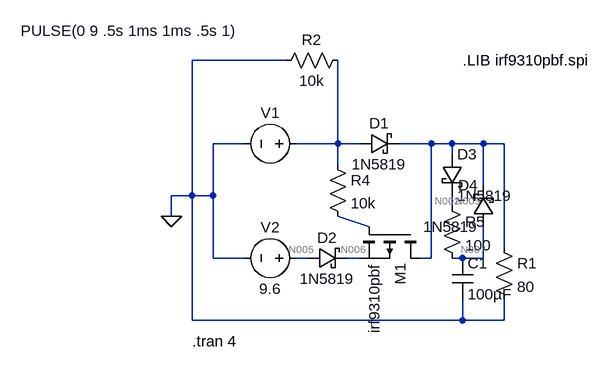
[diagram p0: schematic draft2.asc]
draft2.asc, the LTspice schematic file:
Version 4
SHEET 1 880 680
WIRE -16 -176 -160 -176
WIRE -80 -48 -128 -48
WIRE 64 -48 64 -176
WIRE 64 -48 0 -48
WIRE 96 -48 64 -48
WIRE 208 -48 160 -48
WIRE 240 -48 208 -48
WIRE 288 -48 240 -48
WIRE 320 -48 288 -48
WIRE 240 -32 240 -48
WIRE 64 -16 64 -48
WIRE 288 16 288 -48
WIRE -160 32 -160 -176
WIRE -160 32 -192 32
WIRE -128 32 -128 -48
WIRE -128 32 -160 32
WIRE 240 48 240 32
WIRE -192 64 -192 32
WIRE 112 80 64 64
WIRE 320 112 320 -48
WIRE -128 128 -128 32
WIRE -80 128 -128 128
WIRE 16 128 0 128
WIRE 96 128 80 128
WIRE 208 128 208 -48
WIRE 208 128 192 128
WIRE 256 128 240 128
WIRE 288 128 288 80
WIRE 288 128 256 128
WIRE -160 224 -160 32
WIRE 256 224 256 192
WIRE 256 224 -160 224
WIRE 320 224 320 192
WIRE 320 224 256 224
FLAG -192 64 0
SYMBOL res 304 96 R0
SYMATTR InstName R1
SYMATTR Value 80
SYMBOL voltage 16 -48 R90
WINDOW 0 -32 56 VBottom 2
WINDOW 3 -189 274 VTop 2
WINDOW 123 0 0 Left 0
WINDOW 39 0 0 Left 0
SYMATTR InstName V1
SYMATTR Value PULSE(0 9 .5s 1ms 1ms .5s 1)
SYMBOL voltage 16 128 R90
WINDOW 0 -32 56 VBottom 2
WINDOW 3 32 56 VTop 2
WINDOW 123 0 0 Left 0
WINDOW 39 0 0 Left 0
SYMATTR InstName V2
SYMATTR Value 9.6
SYMBOL pmos 192 80 R90
SYMATTR InstName M1
SYMATTR Value irf9310pbf
SYMATTR Prefix X
SYMBOL res 80 -192 R90
WINDOW 0 0 56 VBottom 2
WINDOW 3 32 56 VTop 2
SYMATTR InstName R2
SYMATTR Value 10k
SYMBOL schottky 96 -32 R270
WINDOW 0 32 32 VTop 2
WINDOW 3 0 32 VBottom 2
SYMATTR InstName D1
SYMATTR Value 1N5819
SYMBOL schottky 16 144 R270
WINDOW 0 32 32 VTop 2
WINDOW 3 0 32 VBottom 2
SYMATTR InstName D2
SYMATTR Value 1N5819
SYMBOL cap 240 128 R0
SYMATTR InstName C1
SYMATTR Value 100µF
SYMBOL res 48 -32 R0
SYMATTR InstName R4
SYMATTR Value 10k
SYMBOL schottky 224 -32 R0
SYMATTR InstName D3
SYMATTR Value 1N5819
SYMBOL res 224 32 R0
SYMATTR InstName R5
SYMATTR Value 100
SYMBOL schottky 304 80 R180
WINDOW 0 24 64 Left 2
WINDOW 3 24 0 Left 2
SYMATTR InstName D4
SYMATTR Value 1N5819
TEXT -160 256 Left 2 !.tran 4
TEXT 256 -176 Left 2 !.LIB irf9310pbf.spi

The netlist it stands for:
* draft2.asc
R1 N002 0 80
V1 N001 0 PULSE(0 9 .5s 1ms 1ms .5s 1)
V2 N005 0 9.6
XM1 N002 N004 N006 irf9310pbf  ; pins D G S
R2 N001 0 10k
D1 N001 N002 1N5819
D2 N005 N006 1N5819
C1 N007 0 100µF
R4 N001 N004 10k
D3 N002 N003 1N5819
R5 N003 N007 100
D4 N007 N002 1N5819
.model D D
.lib standard.dio
.tran 4
.LIB irf9310pbf.spi
.backanno
.end

* Results of the author's LTspice run, read from the files saved beside the schematic
* Operating Point, zero values left out:
*   V(n002) = 9.302 V
*   V(n005) = 9.6 V
*   V(n006) = 9.303 V
*   V(n007) = 9.302 V
*   V(n003) = 9.302 V
*   I(D1) = -31.7 µA
*   I(D2) = 116.3 mA
*   I(R1) = 116.3 mA
*   I(V1) = 31.7 µA
*   I(V2) = -116.3 mA
*   Ix(m1:1) = -116.3 mA
*   Ix(m1:3) = 116.3 mA
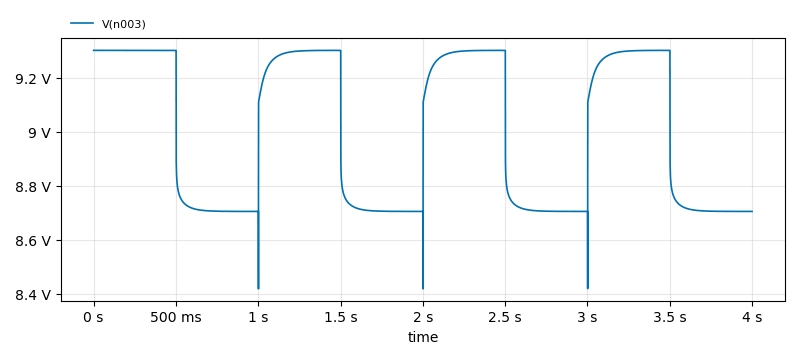
[diagram p1: Transient Analysis of draft2.asc, plotted from the saved traces]
* Transient Analysis, 1 run:
*   V(n003): min 8.419 V, max 9.302 V, average 9.001 V, rms 9.006 V, last 8.705 V